# EAGLE design encoder (EAGLE 6.5.0)
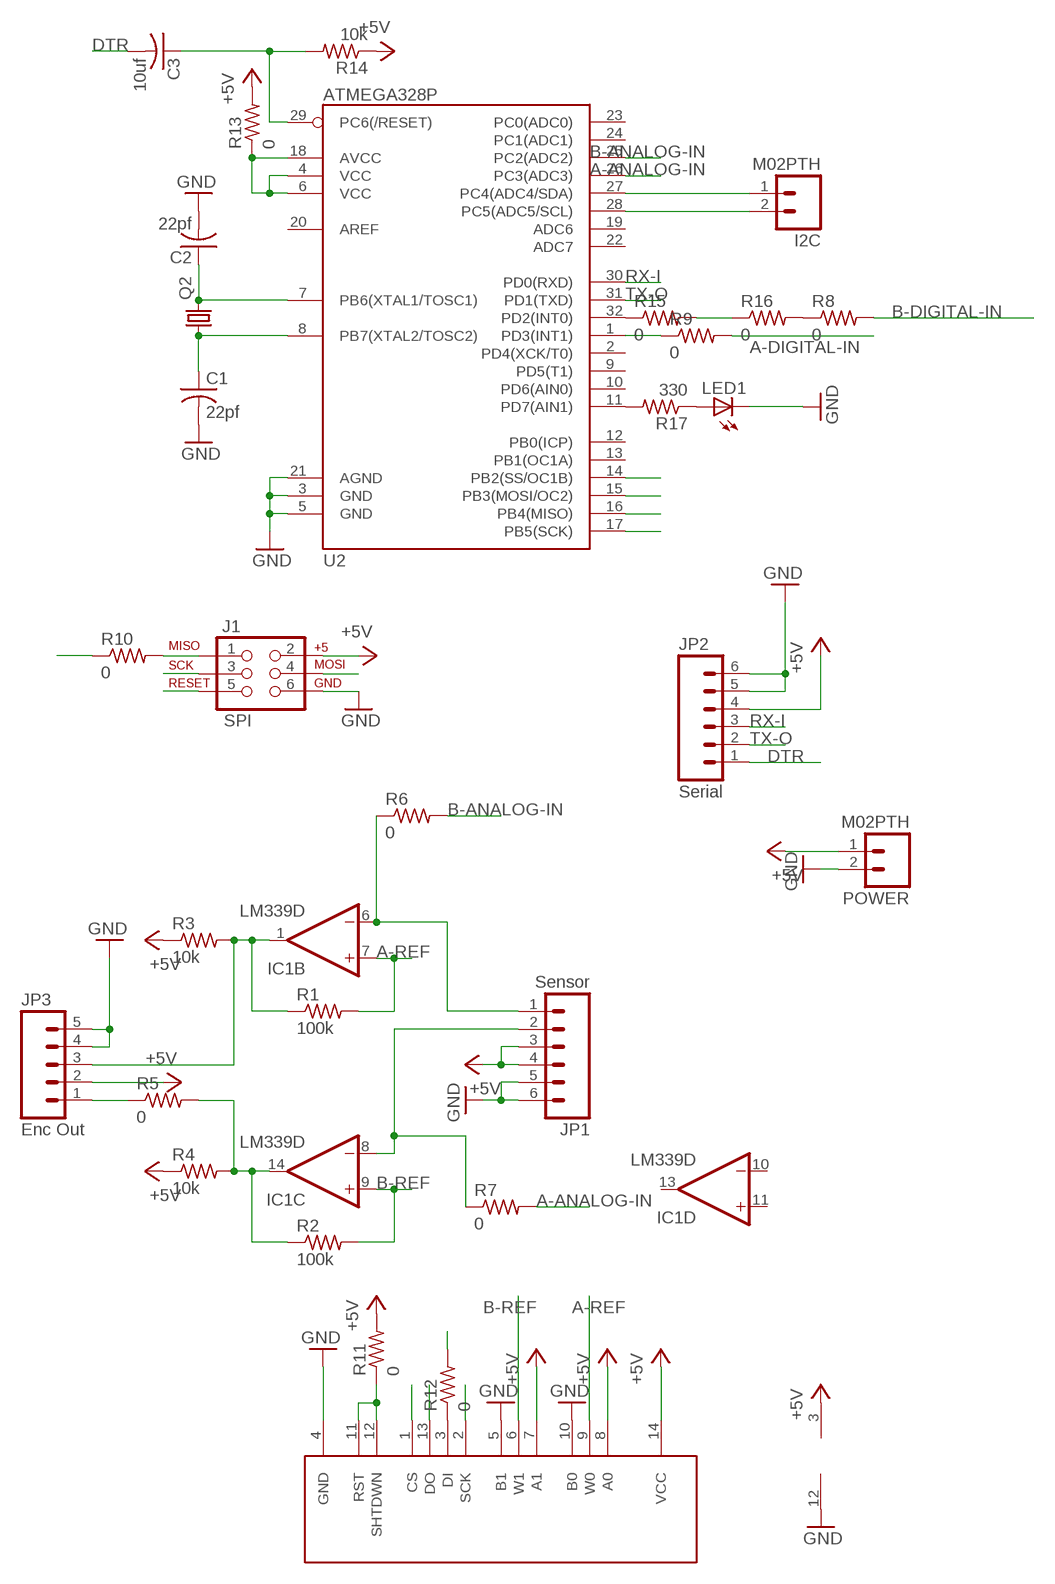
[diagram p0: schematic, sheet 1]

## Parts
C1  22pf  C-USC1206  [C1206]
C2  22pf  C-USC1206  [C1206]
C3  10uf  C-USC1206  [C1206]
I2C  M02PTH  [1X02]
IC1  LM339D  [SO14]
J1  SPI  AVR_SPI_PRG_6NS  [2X3-NS]
JP1  Sensor  M06SIP  [1X06]
JP2  Serial  M06SIP  [1X06]
JP3  Enc Out  M05NO_SILK  [1X05_NO_SILK]
LED1  LEDSMT1206  [1206]
POWER  M02PTH  [1X02]
Q2  CRYSTALHC49UP  [HC49UP]
R1  100k  R-US_R1206  [R1206]
R2  100k  R-US_R1206  [R1206]
R3  10k  R-US_R1206  [R1206]
R4  10k  R-US_R1206  [R1206]
R5  0  R-US_R1206  [R1206]
R6  0  R-US_R1206  [R1206]
R7  0  R-US_R1206  [R1206]
R8  0  R-US_R1206  [R1206]
R9  0  R-US_R1206  [R1206]
R10  0  R-US_R1206  [R1206]
R11  0  R-US_R1206  [R1206]
R12  0  R-US_R1206  [R1206]
R13  0  R-US_R1206  [R1206]
R14  10k  R-US_R1206  [R1206]
R15  0  R-US_R1206  [R1206]
R16  0  R-US_R1206  [R1206]
R17  330  R-US_R1206  [R1206]
U1  MCP42XXX  [SO014]
U2  ATMEGA328P  ATMEGA328_SMT  [TQFP32-08]

## Nets
+5V: IC1.3(P:V+) J1.2 JP1.3 JP1.4 JP2.4 JP3.2 POWER.1 R3.1 R4.1 R11.2 R13.2 R14.1 U1.7(A1) U1.8(A0) U1.14(VCC)
A-ANALOG-IN: R7.2 U2.26(PC3(ADC3))
A-DIGITAL-IN: IC1.1(B:OUT) JP3.3 R1.1 R3.2 R9.2
A-REF: IC1.7(B:+IN) R1.2 U1.9(W0)
B-ANALOG-IN: R6.2 U2.25(PC2(ADC2))
B-DIGITAL-IN: JP3.1 R5.1 R8.2
B-REF: IC1.9(C:+IN) R2.2 U1.6(W1)
DTR: C3.2 JP2.1
GND: C1.2 C2.2 IC1.12(P:GND) J1.6 JP1.5 JP1.6 JP2.5 JP2.6 JP3.4 JP3.5 LED1.C POWER.2 U1.4(GND) U1.5(B1) U1.10(B0) U2.3(GND) U2.5(GND) U2.21(AGND)
MISO: R10.1 U1.13(DO) U2.16(PB4(MISO))
MOSI: J1.4 R12.2 U2.15(PB3(MOSI/OC2))
N$1: IC1.8(C:-IN) JP1.2 R7.1
N$2: J1.1 R10.2
N$3: IC1.6(B:-IN) JP1.1 R6.1
N$4: R11.1 U1.11(RST) U1.12(SHTDWN)
N$5: IC1.14(C:OUT) R2.1 R4.2 R5.2
N$6: R15.1 U2.32(PD2(INT0))
N$7: R9.1 U2.1(PD3(INT1))
N$8: R12.1 U1.3(DI)
N$9: R13.1 U2.4(VCC) U2.6(VCC) U2.18(AVCC)
N$10: C1.1 Q2.1 U2.8(PB7(XTAL2/TOSC2))
N$11: C2.1 Q2.2 U2.7(PB6(XTAL1/TOSC1))
N$12: I2C.1 U2.27(PC4(ADC4/SDA))
N$13: I2C.2 U2.28(PC5(ADC5/SCL))
N$14: R15.2 R16.1
N$15: R8.1 R16.2
N$16: LED1.A R17.1
N$17: R17.2 U2.11(PD7(AIN1))
RESET: C3.1 J1.5 R14.2 U2.29(PC6(/RESET))
RX-I: JP2.3 U2.30(PD0(RXD))
SCK: J1.3 U1.2(SCK) U2.17(PB5(SCK))
SS: U1.1(CS) U2.14(PB2(SS/OC1B))
TX-O: JP2.2 U2.31(PD1(TXD))
Unconnected: IC1.2(A:OUT) IC1.4(A:-IN) IC1.5(A:+IN) IC1.10(D:-IN) IC1.11(D:+IN) IC1.13(D:OUT) U2.2(PD4(XCK/T0)) U2.9(PD5(T1)) U2.10(PD6(AIN0)) U2.12(PB0(ICP)) U2.13(PB1(OC1A)) U2.19(ADC6) U2.20(AREF) U2.22(ADC7) U2.23(PC0(ADC0)) U2.24(PC1(ADC1))

## Library data of the parts
C1-C3 = resistor:C-US: CAPACITOR, American symbol
I2C POWER = SparkFun-Connectors:M02: Standard 2-pin 0.1" header. Use with - straight break away headers ( PRT-00116) - right angle break away headers (PRT-00553) - swiss pins (PRT-00743) - machine pins (PRT-00117) - female headers (PRT-00115) Molex polarized connector foot print use with: PRT-08233 with associated crimp pins and housings. 2.54_SCREWTERM for use with PRT-10571. 3.5mm Screw Terminal footprints for PRT-08084 5mm Screw Terminal footprints for use with PRT-08433
IC1 = linear:LM339: Low Power Low Offset Voltage Quad Comparators with open collector; LM139/LM239/LM339/LM2901/LM3302
J1 = SparkFun-Connectors:AVR_SPI_PRG_6: AVR ISP 6 Pin This is the reduced ISP connector for AVR programming. Common on Arduino. This footprint will take up less PCB space and can be used with a 10-pin to 6-pin adapter such as SKU: BOB-08508
JP1 JP2 = SparkFun-Connectors:M06: Header 6 Standard 6-pin 0.1" header. Use with straight break away headers (SKU : PRT-00116), right angle break away headers (PRT-00553), swiss pins (PRT-00743), machine pins (PRT-00117), and female headers (PRT-00115). Molex polarized connector foot print use with SKU : PRT-08094 with associated crimp pins and housings. NOTES ON THE VARIANTS LOCK and LOCK_LONGPADS... This footprint was designed to help hold the alignment of a through-hole component (i.e. 6-pin header) while soldering it into place. You may notice that each hole has been shifted either up or down by 0.005 of an inch from it's more standard position (which is a perfectly straight line). This slight alteration caused the pins (the squares in the middle) to touch the edges of the holes. Because they are alternating, it causes a "brace" to hold the component in place. 0.005 has proven to be the perfect amount of "off-center" position when using our standard breakaway headers. Although looks a little odd when you look at the bare footprint, once you have a header in there, the alteration is very hard to notice. Also,if you push a header all the way into place, it is covered up entirely on the bottom side. This idea of altering the position of holes to aid alignment will be further integrated into the Sparkfun Library for other footprints. It can help hold any component with 3 or more connection pins.
JP3 = SparkFun-Connectors:M05: Header 5 Standard 5-pin 0.1" header. Use with straight break away headers (SKU : PRT-00116), right angle break away headers (PRT-00553), swiss pins (PRT-00743), machine pins (PRT-00117), and female headers (PRT-00115). Molex polarized connector foot print use with SKU : PRT-08230 with associated crimp pins and housings.
LED1 = led:LED: LED OSRAM: - CHIPLED LG R971, LG N971, LY N971, LG Q971, LY Q971, LO R971, LY R971 LH N974, LH R974 LS Q976, LO Q976, LY Q976 LO Q996 - Hyper CHIPLED LW Q18S LB Q993, LB Q99A, LB R99A - SideLED LS A670, LO A670, LY A670, LG A670, LP A670 LB A673, LV A673, LT A673, LW A673 LH A674 LY A675 LS A676, LA A676, LO A676, LY A676, LW A676 LS A679, LY A679, LG A679 - Hyper Micro SIDELED® LS Y876, LA Y876, LO Y876, LY Y876 LT Y87S - SmartLED LW L88C, LW L88S LB L89C, LB L89S, LG L890 LS L89K, LO L89K, LY L89K LS L896, LA L896, LO L896, LY L896 - TOPLED LS T670, LO T670, LY T670, LG T670, LP T670 LSG T670, LSP T670, LSY T670, LOP T670, LYG T670 LG T671, LOG T671, LSG T671 LB T673, LV T673, LT T673, LW T673 LH T674 LS T676, LA T676, LO T676, LY T676, LB T676, LH T676, LSB T676, LW T676 LB T67C, LV T67C, LT T67C, LS T67K, LO T67K, LY T67K, LW E67C LS E67B, LA E67B, LO E67B, LY E67B, LB E67C, LV E67C, LT E67C LW T67C LS T679, LY T679, LG T679 LS T770, LO T770, LY T770, LG T770, LP T770 LB T773, LV T773, LT T773, LW T773 LH T774 LS E675, LA E675, LY E675, LS T675 LS T776, LA T776, LO T776, LY T776, LB T776 LHGB T686 LT T68C, LB T68C - Hyper Mini TOPLED® LB M676 - Mini TOPLED Santana® LG M470 LS M47K, LO M47K, LY M47K Source: http://www.osram.convergy.de LUXEON: - LUMILED® LXK2-PW12-R00, LXK2-PW12-S00, LXK2-PW14-U00, LXK2-PW14-V00 LXK2-PM12-R00, LXK2-PM12-S00, LXK2-PM14-U00 LXK2-PE12-Q00, LXK2-PE12-R00, LXK2-PE12-S00, LXK2-PE14-T00, LXK2-PE14-U00 LXK2-PB12-K00, LXK2-PB12-L00, LXK2-PB12-M00, LXK2-PB14-N00, LXK2-PB14-P00, LXK2-PB14-Q00 LXK2-PR12-L00, LXK2-PR12-M00, LXK2-PR14-Q00, LXK2-PR14-R00 LXK2-PD12-Q00, LXK2-PD12-R00, LXK2-PD12-S00 LXK2-PH12-R00, LXK2-PH12-S00 LXK2-PL12-P00, LXK2-PL12-Q00, LXK2-PL12-R00 Source: www.luxeon.com KINGBRIGHT: KA-3528ASYC Source: www.kingbright.com
Q2 = crystal:CRYSTAL: CRYSTAL; OC_FARNELL: unknown; OC_NEWARK: unknown
R1-R17 = resistor:R-US_: RESISTOR, American symbol
U1 = SparkFun-AnalogIC:MCP42XXX: SPI controlled dual digital potentiometer by Microchip
U2 = SparkFun-DigitalIC:ATMEGA328_SMT: 32-Pin Atmega328 part Commonly used on Arduino compatible boards Available in QFP and QFN packages TQFP is IC-09069 QFN is non-stock; PROD_ID: IC-09069

## Net classes
0 default: width 0.254 mm, clearance 0.203 mm

## Board
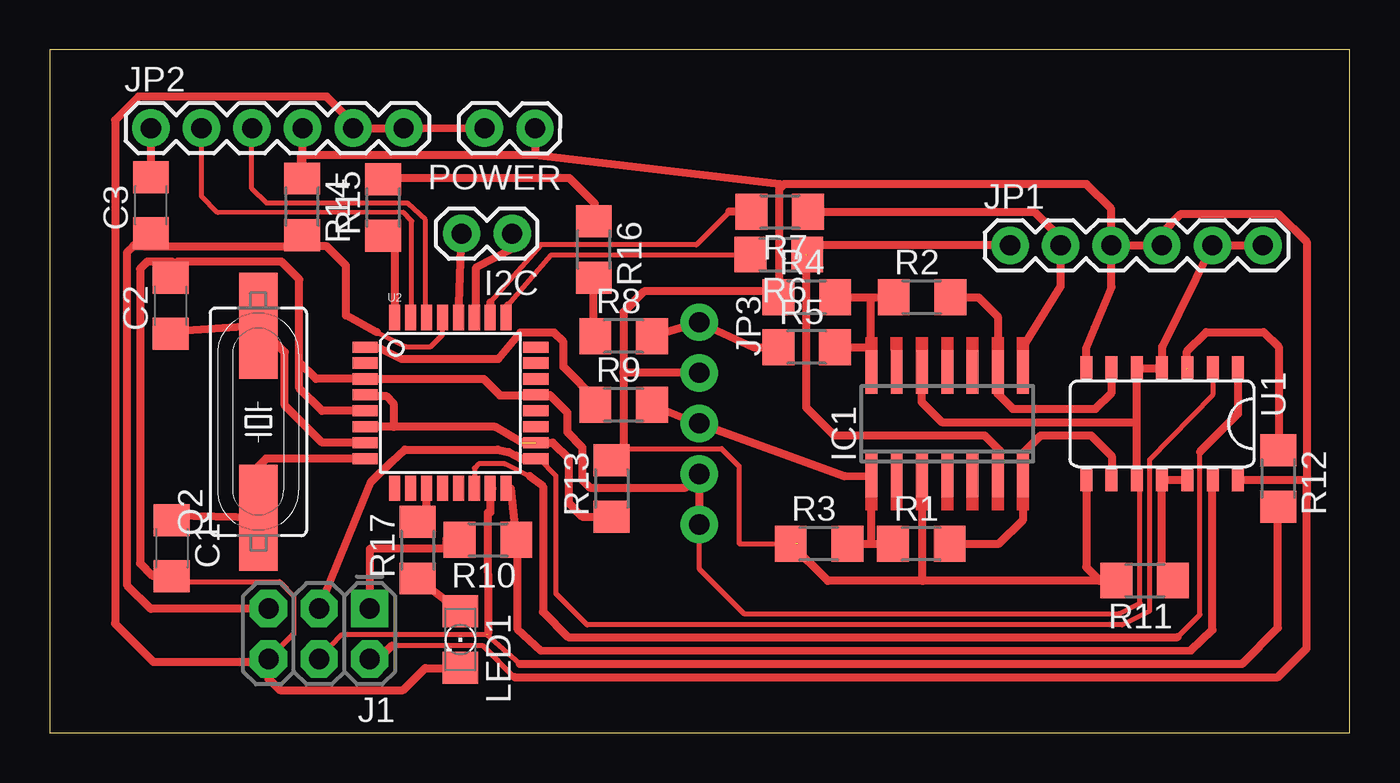
[diagram p1: board, top side]

Size 65.32 x 34.31 mm. Coordinates in mm from the lower left corner, seen from the top.
Outline: 0,0 65.32,0 65.32,34.31 0,34.31 0,0
Copper layers (1*16): Top 0.035mm / dielectric 1.5mm / Bottom 0.035mm
Design rules "default": minimum track width 10mil, minimum drill 24mil, track to track 8mil, track to pad 8mil, pad to pad 8mil, via to via 8mil, smd to smd 8mil, copper to edge 40mil, drill to drill 8mil, minimum pad ring 10mil, minimum via ring 8mil, stop-mask expansion 4mil, vias tented up to drill 0mil, thermal gap 10mil

### Footprints (pad centres in the part's own frame; a part is rotated, then mirrored left to right if it is on the bottom)
C1206 = smd 1.6 x 1.8: 1 -1.4,0; 2 1.4,0
1X02 = drill 1.016 pad 1.88: 1 0,0; 2 2.54,0
SO14 = smd 0.6 x 2.2: 1 -3.81,-2.6; 2 -2.54,-2.6; 3 -1.27,-2.6; 4 0,-2.6; 5 1.27,-2.6; 6 2.54,-2.6; 7 3.81,-2.6; 8 3.81,2.6; 9 2.54,2.6; 10 1.27,2.6; 11 0,2.6; 12 -1.27,2.6; 13 -2.54,2.6; 14 -3.81,2.6
2X3-NS = drill 1.016 pad 1.88 square: 1 -2.54,-1.27 | drill 1.016 pad 1.88 octagon: 2 -2.54,1.27; 3 0,-1.27; 4 0,1.27; 5 2.54,-1.27; 6 2.54,1.27
1X06 = drill 1.016 pad 1.88: 1 0,0; 2 2.54,0; 3 5.08,0; 4 7.62,0; 5 10.16,0; 6 12.7,0
1X05_NO_SILK = drill 1.016 pad 1.88: 1 0,0; 2 2.54,0; 3 5.08,0; 4 7.62,0; 5 10.16,0
1206 = smd 1.6 x 1.803: A -1.422,0; C 1.422,0
HC49UP = smd 5.334 x 1.93: 1 -4.826,0; 2 4.826,0
R1206 = smd 1.6 x 1.803: 1 -1.422,0; 2 1.422,0
SO014 = smd 0.6 x 1.2: 1 -3.175,-2.8; 2 -1.905,-2.8; 3 -0.635,-2.8; 4 0.635,-2.8; 5 1.905,-2.8; 6 3.175,-2.8; 7 4.445,-2.8; 8 4.445,2.8; 9 3.175,2.8; 10 1.905,2.8; 11 0.635,2.8; 12 -0.635,2.8; 13 -1.905,2.8; 14 -3.175,2.8
TQFP32-08 = smd 1.27 x 0.559: 1 -4.293,2.8; 2 -4.293,2; 3 -4.293,1.2; 4 -4.293,0.4; 5 -4.293,-0.4; 6 -4.293,-1.2; 7 -4.293,-2; 8 -4.293,-2.8; 17 4.293,-2.8; 18 4.293,-2; 19 4.293,-1.2; 20 4.293,-0.4; 21 4.293,0.4; 22 4.293,1.2; 23 4.293,2; 24 4.293,2.8 | smd 0.559 x 1.27: 9 -2.8,-4.293; 10 -2,-4.293; 11 -1.2,-4.293; 12 -0.4,-4.293; 13 0.4,-4.293; 14 1.2,-4.293; 15 2,-4.293; 16 2.8,-4.293; 25 2.8,4.293; 26 2,4.293; 27 1.2,4.293; 28 0.4,4.293; 29 -0.4,4.293; 30 -1.2,4.293; 31 -2,4.293; 32 -2.8,4.293

### Placement (x,y rotation side)
C1  6.13,9.28 270 top
C2  6.08,21.45 90 top
C3  5.08,26.5 90 top
I2C  23.23,25.08 180 top
IC1  45.09,15.53 0 top
J1  13.53,4.98 180 top
JP1  48.26,24.49 0 top
JP2  5.08,30.38 0 top
JP3  32.63,20.63 270 top
LED1  20.63,4.69 270 top
POWER  24.38,30.36 179.7 top
Q2  10.48,15.63 90 top
R1  43.8,9.5 0 top
R2  43.82,21.88 0 top
R3  38.65,9.5 0 top
R4  38.04,21.88 0 top
R5  38.03,19.38 0 top
R6  36.63,24.03 180 top
R7  36.68,26.18 180 top
R8  28.83,19.93 0 top
R9  28.83,16.48 0 top
R10  22.02,9.7 180 top
R11  55.02,7.65 180 top
R12  61.73,12.78 270 top
R13  28.23,12.28 90 top
R14  12.68,26.43 270 top
R15  16.75,26.39 90 top
R16  27.33,24.28 270 top
R17  18.48,9.18 90 top
U1  56.52,15.53 180 top
U2  20.13,16.58 0 top

### Tracks (layer width: path | path; a pad name or v marks a point on that pad's centre or on a via)
+5V  (1 unrouted)
  Top 0.254: 17.21,4.4 21.74,4.4 23.34,2.8 | 28.83,14.28 33.76,14.28 34.63,13.4 34.63,9.5 37.6,9.5 37.72,9.38
  Top 0.406: JP1.3 JP1.4 55.88,25.1 56.84,26.07 61.74,26.07 63.15,24.66 63.15,11.68 63.16,11.67 | U1.7 52.08,19.31 52.5,20.35 53.35,22.38 53.34,22.38 JP1.3 | 36.67,27.33 36.67,21.88 R4.1 36.62,22.18 29.86,22.18 28.82,21.13 28.82,18.1 28.83,18.09 | 36.67,27.33 36.67,27.58 24.38,29.03 | 37.51,9.5 R3.1 39.09,7.64 43.86,7.64 | U1.14 63.16,12.73 63.16,12.72 63.16,11.67 | JP3.2 28.83,18.09 | 28.83,18.09 28.83,14.28 28.83,13.7 R13.2 | 24.38,29.03 12.63,29.03 12.63,28.65 R14.1 12.68,30.23 JP2.4 | POWER.1 24.38,29.03 | R11.2 52.76,7.64 | 52.76,7.64 43.86,7.64 | U1.8 52.08,8.32 52.76,7.64 | IC1.3 43.82,7.68 43.86,7.64 | J1.2 16.52,3.71 17.21,4.4 | 23.34,2.8 61.72,2.8 63.16,4.24 63.16,11.67 | JP1.3 53.34,26.31 52.09,27.56 36.9,27.56 36.67,27.33
A-ANALOG-IN
  Top 0.254: 22.13,21.63 24.68,24.53 24.7,24.51 32.48,24.51 34.15,26.18
  Top 0.406: 22.13,21.63 U2.26 | R7.2 34.15,26.18
A-DIGITAL-IN
  Top 0.406: R3.2 41.25,9.5 | 41.25,9.5 42.53,9.5 R1.1 | IC1.1 41.25,12.93 | 41.25,12.93 41.25,9.5 | 41.25,12.93 39.95,12.9 JP3.3 32.68,15.48 R9.2
A-REF
  Top 0.406: U1.9 53.36,12.73 53.36,13.9 52.32,14.94 49.79,14.94 48.9,14.05 48.9,13.44 | IC1.7 48.9,13.44 | R1.2 47.7,9.5 48.91,10.72 48.91,13.43 48.9,13.44
B-ANALOG-IN
  Top 0.254: R6.2 34.72,24.03 34.72,23.98 25.16,23.99 23.01,21.48
  Top 0.406: 23.01,21.48 U2.25
B-DIGITAL-IN
  Top 0.406: R5.1 35.36,19.38 JP3.1 32.58,20.63 R8.2
B-REF
  Top 0.406: 53.39,18.33 U1.6 53.36,18.32 53.36,17.09 52.54,16.28 48.38,16.28 47.63,17.03 IC1.9 47.64,20.91 46.67,21.88 R2.2
DTR
  Top 0.406: JP2.1 C3.2
GND
  Top 0.254: JP3.4 32.63,8.24 34.88,5.99 53.73,5.99 54.78,6.52 54.78,12.68 U1.10 | 6.75,7.59 11.54,7.59 12.27,6.87 12.27,4.98 J1.6
  Top 0.406: IC1.12 43.81,18.13 43.81,16.62 44.82,15.61 54.62,15.61 | JP1.6 JP1.5 55.91,19.4 55.89,19.4 U1.4 U1.5 54.62,15.61 | 54.62,15.61 U1.10 54.63,12.73 | JP3.5 JP3.4 31.95,12.32 27.14,12.32 26.75,12.71 26.75,14.34 25.99,15.11 26,16.1 25.13,16.98 U2.21 | 24.43,16.93 U2.21 | C2.2 6.14,23.18 6.14,23.36 | 6.14,23.36 6.14,23.67 4.9,23.67 4.54,23.3 4.54,8.52 5.16,7.9 6.11,7.9 | 6.28,7.61 6.28,7.88 C1.2 6.11,7.9 | 10.99,3.58 J1.6 | POWER.2 17.78,30.34 JP2.6 JP2.5 15.24,30.63 13.92,31.96 4.46,31.96 3.28,30.78 3.28,5.48 5.2,3.56 10.85,3.56 J1.6 | 6.11,7.9 6.45,7.9 6.75,7.59 | J1.6 10.99,2.72 11.57,2.14 17.75,2.14 18.86,3.26 20.62,3.26 LED1.C | U2.21 24.4,16.95 22.62,16.95 21.8,17.78 U2.3 13.38,17.78 12.54,18.62 | U2.5 13.68,16.18 12.54,17.31 12.54,18.62 | 12.54,18.62 12.54,22.78 11.65,23.68 6.45,23.68 6.14,23.36
MISO
  Top 0.406: U2.16 23.16,12.28 R10.1 23.48,9.73 23.48,5.23 24.68,4.13 57.34,4.14 58.42,5.17 U1.13
MOSI  (1 unrouted)
  Top 0.254: J1.4 13.53,3.76 14.69,4.95 21.95,4.95 23.62,3.47 | 61.72,11.34 R12.2
  Top 0.406: 22.23,12.28 U2.15 22.13,11.08 22.01,11.06 22.02,4.97 | R12.2 62.03,11.35 | 23.62,3.47 59.91,3.47 61.72,5.27 61.72,11.34
N$1
  Top 0.406: IC1.8 48.91,19.4 50.8,22.43 JP1.2 50.8,24.85 49.5,26.15 38.13,26.15 R7.1
N$2
  Top 0.406: R10.2 19.93,9.73 19.88,9.24 16.07,9.24 J1.1
N$3  (1 unrouted)
  Top 0.406: JP1.1 38.06,24.49 R6.1 | 38,24.04 38,16.35 39.4,14.94 46.97,14.94 47.72,14.2 47.72,13.01 IC1.6
N$4
  Top 0.406: R11.1 55.89,8.18 U1.11 U1.12
N$5
  Top 0.406: R4.2 41.27,21.88 | 41.27,21.88 R2.1 | IC1.14 41.27,19.38 | 41.27,19.38 41.27,21.88 | R5.2 41.27,19.38
N$6
  Top 0.406: R15.1 17.33,25 U2.32
N$7
  Top 0.406: R9.1 27.53,16.48 27.53,16.66 25.81,18.38 25.81,19.64 25.34,20.1 23.63,20.1 22.53,18.78 17.68,18.78 16.58,19.33 15.84,19.33 U2.1
N$8  (1 unrouted)
  Top 0.406: 61.78,14.2 R12.1 61.74,19.39 61,20.13 58.11,20.13 57.13,19.16 57.13,18.29
N$9  (1 unrouted)
  Top 0.254: R13.1 | 17.28,15.4 17.3,15.38
  Top 0.406: U2.4 15.84,16.93 16.89,16.93 17.28,16.54 17.28,15.4 | 23.73,14.58 22.38,15.38 17.3,15.38 U2.6 | 28.23,10.83 R13.1 | U2.18 25.28,14.58 26.07,13.78 26.07,11.55 26.75,10.86 R13.1
N$10
  Top 0.406: C1.1 6.13,10.9 Q2.1 10.47,10.81 10.47,13.38 10.87,13.78 U2.8
N$11
  Top 0.406: 10.48,21.48 Q2.2 | Q2.2 6.13,20.15 C2.1 | U2.7 13.69,14.58 11.81,16.46 11.81,19.13 Q2.2
N$12
  Top 0.406: U2.27 21.43,20.87 21.43,23.38 23.23,24.33 I2C.1
N$13
  Top 0.406: U2.28 20.53,20.84 I2C.2
N$14
  Top 0.406: 27.38,25.7 R16.1 27.38,25.75 27.38,26.59 26.1,27.88 16.73,27.88 R15.2
N$15
  Top 0.406: R8.1 27.33,19.93 R16.2
N$16
  Top 0.406: LED1.A R17.1
N$17
  Top 0.406: R17.2 18.93,10.6 U2.11
RESET
  Top 0.254: 19.78,20.87 U2.29 19.73,19.99 19.14,19.4 17.88,19.4 16.43,20.13
  Top 0.406: 16.43,20.13 14.88,20.98 14.88,23.47 13.91,24.44 12.54,24.44 12.53,24.43 | C3.1 5.03,24.93 5.03,24.43 | R14.2 12.68,25.05 12.53,24.43 | 12.53,24.43 5.03,24.43 | 5.03,24.43 4.78,24.43 4.73,24.47 4.21,24.47 3.9,24.16 3.9,7.4 5.08,6.22 10.97,6.22 J1.5
RX-I
  Top 0.254: 18.88,20.87 18.88,25.77 17.97,26.61 10.89,26.61 10.15,27.33 10.15,30.36 JP2.3
  Top 0.406: U2.30 18.88,20.87
SCK
  Top 0.254: U1.2 58.43,16.98 55.25,13.73 55.25,6.12 53.89,5.43 27,5.43 25.42,7 25.42,7.01 25.42,12.92 24.57,13.78 U2.17
  Top 0.406: J1.3 16.15,12.6 17.21,13.64 17.83,14.23 22.52,14.23 23.07,14.1 23.41,13.93 23.69,13.78 U2.17
SS
  Top 0.254: 24.11,12.9 22.87,13.51 21.56,13.51 21.34,13.29 U2.14 | 56.67,4.81 57.8,5.94 57.8,14.12
  Top 0.406: 24.11,12.9 24.78,12.38 24.78,6.08 26.05,4.81 56.67,4.81 | U1.1 59.7,16.02 57.8,14.12
TX-O
  Top 0.254: 18.18,20.87 18.18,25.72 17.77,26.14 8.44,26.13 7.63,26.96 JP2.2
  Top 0.406: U2.31 18.18,20.87
(copper drawn outside any net)
  shapes: Top area x18